# Altium project inwall_wifi.PrjPcb
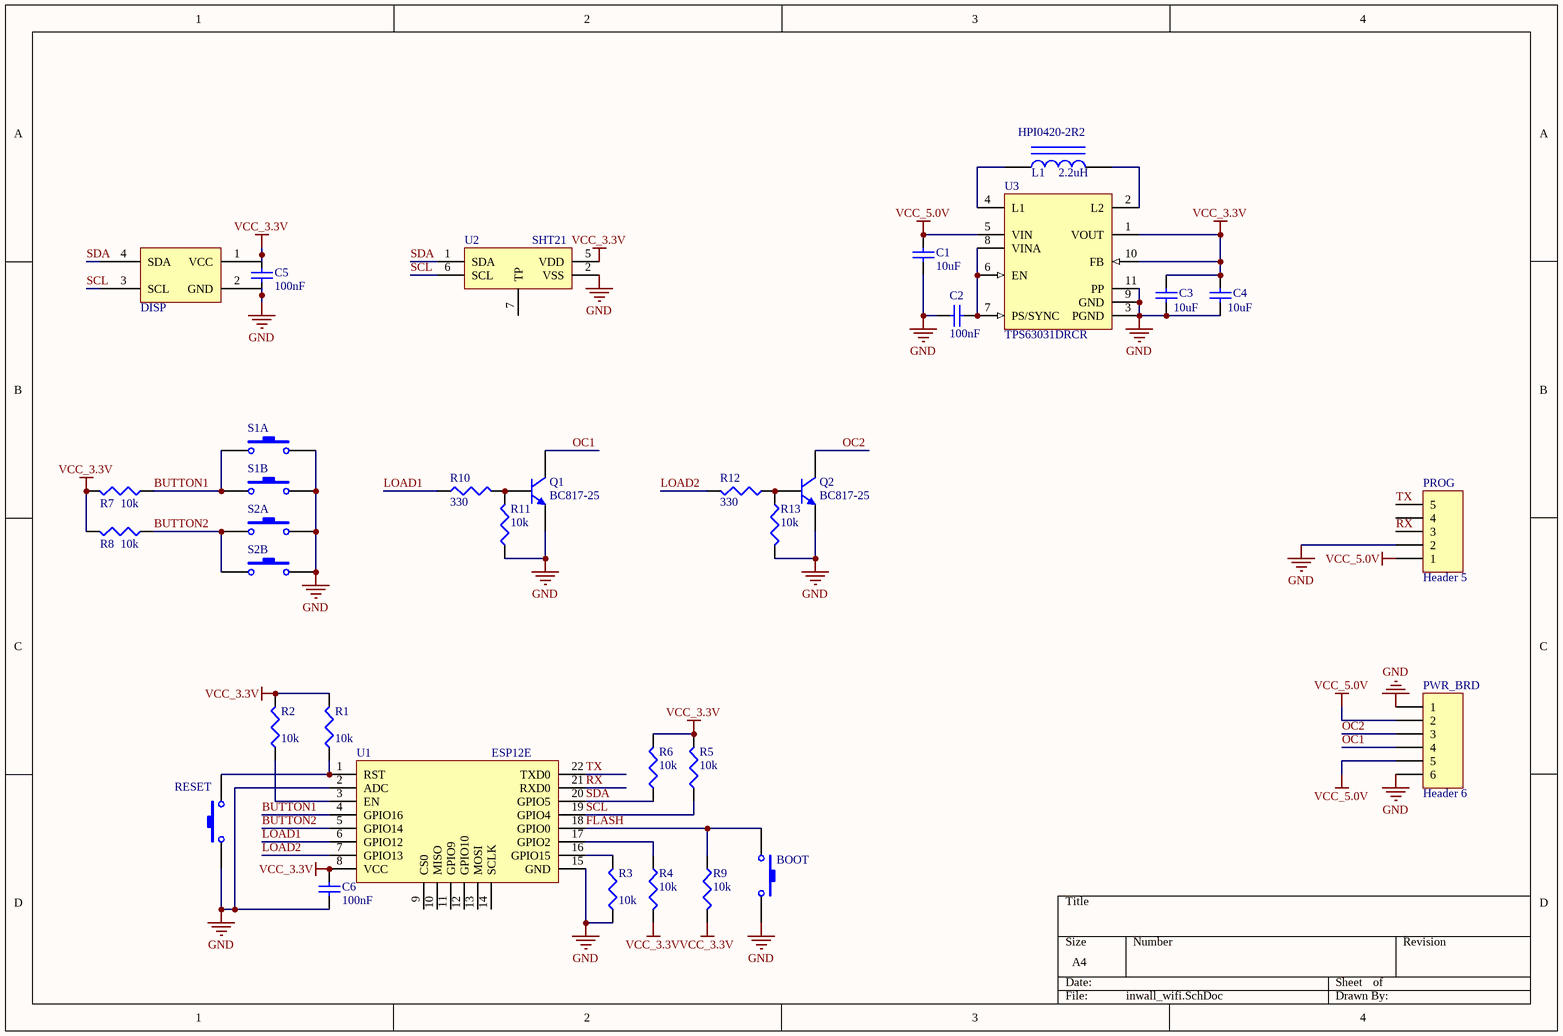
[diagram p0: inwall_wifi.SchDoc]
1 sheet, 34 parts. Net scope: global (net labels, ports and power ports of the same name join across sheets).
Board files: inwall_wifi.PcbDoc, inwall_wifi_sensor.PcbDoc

## Sheet inwall_wifi.SchDoc
size A4

### Parts
BOOT  SW-PB  [B3U-1000P(M)]  (value not drawn)
C1  value 10uF  [1608[0603]]  (hidden comment: Cap Semi)
C2  value 100nF  [1608[0603]]  (hidden comment: Cap Semi)
C3  value 10uF  [1608[0603]]  (hidden comment: Cap Semi)
C4  value 10uF  [1608[0603]]  (hidden comment: Cap Semi)
C5  value 100nF  [1608[0603]]  (hidden comment: Cap Semi)
C6  value 100nF  [1608[0603]]  (hidden comment: Cap Semi)
DISP  0.96'' OLED I2C  [OLED_I2C]  (value not drawn)
L1  HPI0420-2R2  value 2.2uH  [HPI 0420]
PROG  Header 5  [HDR1X5]
PWR_BRD  Header 6  [HDR1X6]
Q1  BC817-25  [SOT-23A_N]
Q2  BC817-25  [SOT-23A_N]
R1  value 10k  [J1-0603]  (hidden comment: Res3)
R2  value 10k  [J1-0603]  (hidden comment: Res3)
R3  value 10k  [J1-0603]  (hidden comment: Res3)
R4  value 10k  [J1-0603]  (hidden comment: Res3)
R5  value 10k  [J1-0603]  (hidden comment: Res3)
R6  value 10k  [J1-0603]  (hidden comment: Res3)
R7  value 10k  [J1-0603]  (hidden comment: Res3)
R8  value 10k  [J1-0603]  (hidden comment: Res3)
R9  value 10k  [J1-0603]  (hidden comment: Res3)
R10  value 330  [J1-0603]  (hidden comment: Res3)
R11  value 10k  [J1-0603]  (hidden comment: Res3)
R12  value 330  [J1-0603]  (hidden comment: Res3)
R13  value 10k  [J1-0603]  (hidden comment: Res3)
RESET  SW-PB  [B3U-1000P(M)]  (value not drawn)
S1A  SW-PB  [B3AL]  (value not drawn)
S1B  SW-PB  [B3AL]  (value not drawn)
S2A  SW-PB  [B3AL]  (value not drawn)
S2B  SW-PB  [B3AL]  (value not drawn)
U1  ESP12E  [ESP12E]
U2  SHT21  [SON100P300X120_HS-7N]
U3  TPS63031DRCR  [DRC10-2400X1650TP]

### Nets
GND: BOOT.2 C1.2 C2.2 C3.1 C4.1 C5.2 C6.2 DISP.2(GND) PROG.2 PWR_BRD.1 PWR_BRD.6 Q1.2(E) Q2.2(E) R3.1 R11.1 R13.2 RESET.1 S1A.2 S1B.2 S2A.2 S2B.2 U1.2(ADC) U1.15(GND) U2.2(VSS) U3.3(PGND) U3.9(GND) U3.11(PP)
VCC_3.3V: C3.2 C4.2 C5.1 C6.1 DISP.1(VCC) R1.2 R2.2 R4.2 R5.2 R6.2 R7.2 R8.2 R9.2 U1.8(VCC) U2.5(VDD) U3.1(VOUT) U3.10(FB)
VCC_5.0V: C1.1 PROG.1 PWR_BRD.2 PWR_BRD.5 U3.5(VIN)
BUTTON1: R7.1 S1A.1 S1B.1 U1.4(GPIO16)
BUTTON2: R8.1 S2A.1 S2B.1 U1.5(GPIO14)
FLASH: BOOT.1 R9.1 U1.18(GPIO0)
LOAD1: R10.1 U1.6(GPIO12)
LOAD2: R12.2 U1.7(GPIO13)
OC1: PWR_BRD.4 Q1.3(C)
OC2: PWR_BRD.3 Q2.3(C)
RX: PROG.3 U1.21(RXD0)
SCL: DISP.3(SCL) R5.1 U1.19(GPIO4) U2.6(SCL)
SDA: DISP.4(SDA) R6.1 U1.20(GPIO5) U2.1(SDA)
TX: PROG.5 U1.22(TXD0)
NetC2_1: C2.1 U3.6(EN) U3.7(PS/SYNC) U3.8(VINA)
NetL1_1: L1.1 U3.4(L1)
NetL1_2: L1.2 U3.2(L2)
NetQ1_1: Q1.1(B) R10.2 R11.2
NetQ2_1: Q2.1(B) R12.1 R13.1
NetR1_1: R1.1 RESET.2 U1.1(RST)
NetR2_1: R2.1 U1.3(EN)
NetR3_2: R3.2 U1.16(GPIO15)
NetR4_1: R4.1 U1.17(GPIO2)

Not connected (* = marked no-connect by the designer): PROG 4; U1 9(CS0) 10(MISO) 11(GPIO9) 12(GPIO10) 13(MOSI) 14(SCLK); U2 7(TP)

### Library data of the parts
BOOT RESET S1A S1B S2A S2B = SW-PB: Switch; Published: 24-Mar-1999; LatestRevisionDate: 17-Jul-2002; LatestRevisionNote: Re-released for DXP Platform.; PackageReference: SPST-2; Publisher: Altium Limited; PackageDescription: Switch; 2 Leads; Supplier 1: Farnell; Supplier 2: Farnell
  BOOT RESET: Supplier Part Number 1: 2500851; Supplier Part Number 2: 1333652
  S1A S1B S2A S2B: Supplier Part Number 1: 1908276RL; Supplier Part Number 2: 1908275; Supplier 3: Farnell; Supplier Part Number 3: 1908272; Supplier 4: Farnell; Supplier Part Number 4: 1908274
C1-C6 = Cap Semi: Capacitor (Semiconductor SIM Model); Published: 8-Jun-2000; LatestRevisionDate: 29-May-2009; LatestRevisionNote: IPC-7351 Footprint Added.; PackageReference: C1206; Publisher: Altium Limited; PackageDescription: Chip Capacitor
DISP = OLED_I2C: Supplier 1: TME; Supplier Part Number 1: REX012864MXPP3N0
L1 = Inductor Iron: Magnetic-Core Inductor; Published: 24-Mar-1999; LatestRevisionDate: 17-Jul-2002; LatestRevisionNote: Re-released for DXP Platform.; PackageReference: AXIAL-0.9; Publisher: Altium Limited; PackageDescription: Axial Device, Thru-Hole; 2 Leads; 0.9 in Pin Spacing; Supplier 1: TME; Supplier Part Number 1: HPI0420-2R2
PROG = Header 5: Header, 5-Pin; LatestRevisionDate: 17-Jul-2002; LatestRevisionNote: Re-released for DXP Platform.; Publisher: Altium Limited
PWR_BRD = Header 6: Header, 6-Pin; LatestRevisionDate: 17-Jul-2002; LatestRevisionNote: Re-released for DXP Platform.; Publisher: Altium Limited
Q1 Q2 = BC817-25: NPN General Purpose Amplifier; Published: 8-Jun-2000; LatestRevisionDate: 20-Nov-2009; LatestRevisionNote: IPC-7351 Footprint Added.; DatasheetVersion: 1997; PackageVersion: Sep-1998; PackageReference: SOT-23A; Publisher: Altium Limited; PackageDescription: 3-Pin SOT-23 Package 0.95 mm Pitch, 2.3 mm Lead Span; ComponentLink1Description: Manufacturer Link; ComponentLink1URL: http://www.fairchildsemi.com/; ComponentLink2Description: Discontinuation Notice; ComponentLink2URL: http://www.fairchildsemi.com/obsolete/obs.jsp
R1-R13 = Res3: Resistor; Published: 8-Jun-2000; LatestRevisionDate: 29-May-2009; LatestRevisionNote: IPC-7351 Footprint Added.; PackageReference: J1-0603; Publisher: Altium Limited; PackageDescription: Chip Resistor
U2 = SHT21: SHT21 H/T sensor
U3 = TPS63001DRCR: Buck-Boost Voltage Converter with 1.8 to 5.5 V Input and 3.3 V Output, -40 to 85 degC, 10-Pin SON (DRC), Green (RoHS & no Sb/Br); Manufacturer: Texas Instruments; Dynamic Voltage Scaling: TRUE; Iout(Max)(A): 1.2; Iq(Typ)(mA): 0.03; Preset Vout(V): 3.3; Regulated Outputs(#): 1; SubFamily: Buck-Boost Regulator; Switching Frequency(Max)(kHz): 1500; Vin(Max)(V): 5.5; Vin(Min)(V): 1.8; DatasheetVersion: SLVS520B; PackageVersion: revL, Sep-2011; PackageReference: DRC10-2400X1650TP; PackageDescription: 10-Pin Plastic Small Outline No-Lead, 3 x 3 x 1 mm Body, 0.5 mm Pitch, Exposed Pad; Supplier 1: Digi-Key; Supplier Part Number 1: 296-19643-2-ND; Supplier 2: Digi-Key; Supplier Part Number 2: 296-19643-1-ND; Supplier 3: Digi-Key; Supplier Part Number 3: 296-19643-6-ND; Supplier 4: Farnell; Supplier Part Number 4: 1412595; Supplier 5: Newark; Supplier Part Number 5: 85K1711; Supplier 6: Mouser; Supplier Part Number 6: 595-TPS63001DRCR; Eco-Plan: Green (RoHS & no Sb/Br); Synchronous Rectification: TRUE; Topology: Buck-Boost; Vout(Max)(V): 3.3; Vout(Min)(V): 3.3; Mounting Technology: Surface Mount; PartNumber: TPS63001DRCR; ComponentLink1Description: Datasheet; ComponentLink1URL: http://www.ti.com/general/docs/lit/getliterature.tsp?genericPartNumber=TPS63001&fileType=pdf; ComponentLink2Description: Package Specification; ComponentLink2URL: http://www.ti.com/litv/pdf/mpds117k; Supplier 7: TME; Supplier Part Number 7: TPS63031DSKT